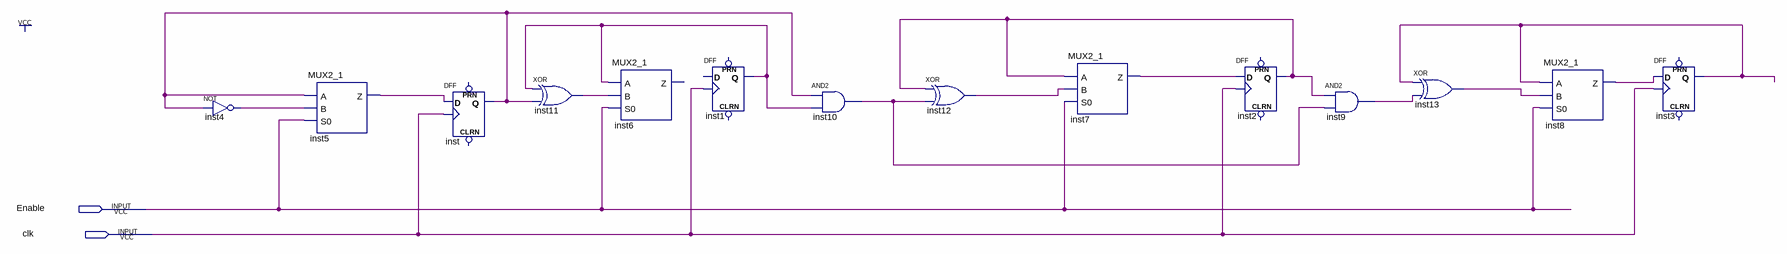
[diagram p0: schematic sheet]
// Quartus schematic upCounter.bdf as structural Verilog: 14 symbols, 2 pins
module upCounter (
  input  Enable,
  input  clk
);

  wire inst1_q, inst2_q, inst3_q, inst4_out, inst5_z, inst7_z, inst8_z, inst9_out, inst10_out, inst11_out,
       inst12_out, inst13_out, inst_q;

  not inst4 (inst4_out, inst_q);
  MUX2_1 inst5 (.A(inst_q), .B(inst4_out), .S0(Enable), .Z(inst5_z));
  DFF inst (.CLK(clk), .D(inst5_z), .Q(inst_q));  // open: CLRN, PRN
  xor inst11 (inst11_out, inst1_q, inst_q);
  MUX2_1 inst6 (.A(inst1_q), .B(inst11_out), .S0(Enable));  // open: Z
  DFF inst1 (.CLK(clk), .Q(inst1_q));  // open: CLRN, D, PRN
  and inst10 (inst10_out, inst_q, inst1_q);
  xor inst12 (inst12_out, inst2_q, inst10_out);
  MUX2_1 inst7 (.A(inst2_q), .B(inst12_out), .S0(Enable), .Z(inst7_z));
  DFF inst2 (.CLK(clk), .D(inst7_z), .Q(inst2_q));  // open: CLRN, PRN
  and inst9 (inst9_out, inst2_q, inst10_out);
  xor inst13 (inst13_out, inst3_q, inst9_out);
  MUX2_1 inst8 (.A(inst3_q), .B(inst13_out), .S0(Enable), .Z(inst8_z));
  DFF inst3 (.CLK(clk), .D(inst8_z), .Q(inst3_q));  // open: CLRN, PRN
endmodule
